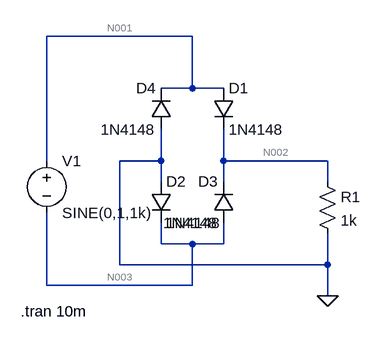
[diagram p0: schematic Draft3.asc]
Draft3.asc, the LTspice schematic file:
Version 4
SHEET 1 880 680
WIRE 288 -32 64 -32
WIRE 288 48 288 -32
WIRE 288 48 240 48
WIRE 336 48 288 48
WIRE 64 160 64 -32
WIRE 240 160 240 112
WIRE 240 160 176 160
WIRE 336 160 336 112
WIRE 496 160 336 160
WIRE 240 192 240 160
WIRE 336 192 336 160
WIRE 496 192 496 160
WIRE 240 288 240 256
WIRE 288 288 240 288
WIRE 336 288 336 256
WIRE 336 288 288 288
WIRE 176 320 176 160
WIRE 496 320 496 272
WIRE 496 320 176 320
WIRE 64 352 64 240
WIRE 288 352 288 288
WIRE 288 352 64 352
WIRE 496 368 496 320
FLAG 496 368 0
SYMBOL voltage 64 144 R0
WINDOW 123 0 0 Left 0
WINDOW 39 0 0 Left 0
SYMATTR InstName V1
SYMATTR Value SINE(0,1,1k)
SYMBOL diode 320 48 R0
SYMATTR InstName D1
SYMATTR Value 1N4148
SYMBOL diode 224 192 R0
SYMATTR InstName D2
SYMATTR Value 1N4148
SYMBOL diode 352 256 R180
WINDOW 0 24 64 Left 2
WINDOW 3 24 0 Left 2
SYMATTR InstName D3
SYMATTR Value 1N4148
SYMBOL diode 256 112 R180
WINDOW 0 24 64 Left 2
WINDOW 3 24 0 Left 2
SYMATTR InstName D4
SYMATTR Value 1N4148
SYMBOL res 480 176 R0
SYMATTR InstName R1
SYMATTR Value 1k
TEXT 24 392 Left 2 !.tran 10m

The netlist it stands for:
* Draft3.asc
V1 N001 N003 SINE(0,1,1k)
D1 N001 N002 1N4148
D2 0 N003 1N4148
D3 N003 N002 1N4148
D4 0 N001 1N4148
R1 N002 0 1k
.model D D
.lib standard.dio
.tran 10m
.backanno
.end

* Results of the author's LTspice run, read from the files saved beside the schematic
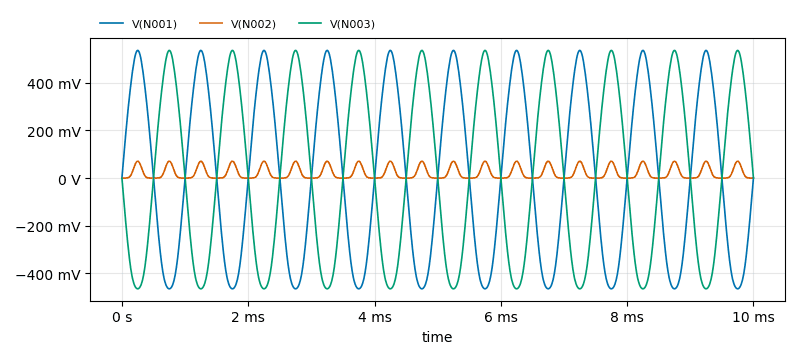
[diagram p1: Transient Analysis of Draft3.asc, plotted from the saved traces]
* Transient Analysis, 1 run:
*   V(N001): min -464.4 mV, max 535.5 mV, average 10.46 mV, rms 353.9 mV, last 0 V
*   V(N002): min 0 V, max 70.7 mV, average 20.92 mV, rms 32.88 mV, last 0 V
*   V(N003): min -464.4 mV, max 535.5 mV, average 10.46 mV, rms 353.9 mV, last 0 V